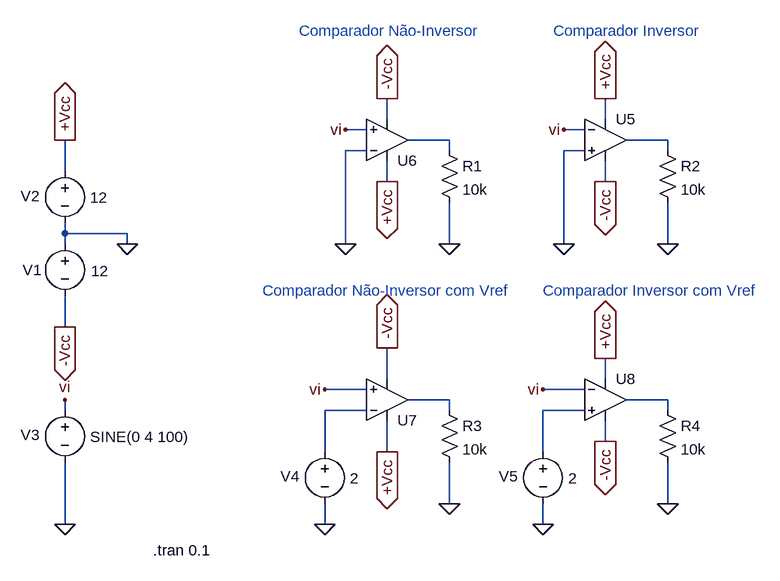
[diagram p0: schematic simulacao_comparadores.asc]
simulacao_comparadores.asc, the LTspice schematic file:
Version 4
SHEET 1 1264 744
WIRE 224 64 224 32
WIRE 560 64 560 32
WIRE 192 80 160 80
WIRE 528 80 496 80
WIRE 320 96 256 96
WIRE 656 96 592 96
WIRE 192 112 160 112
WIRE 320 112 320 96
WIRE 528 112 496 112
WIRE 656 112 656 96
WIRE -272 144 -272 96
WIRE 224 160 224 128
WIRE 560 160 560 128
WIRE -272 240 -272 224
WIRE -176 240 -272 240
WIRE -272 256 -272 240
WIRE -176 256 -176 240
WIRE 160 256 160 112
WIRE 320 256 320 192
WIRE 496 256 496 112
WIRE 656 256 656 192
WIRE -272 384 -272 336
WIRE 224 464 224 416
WIRE 560 464 560 432
WIRE 192 480 128 480
WIRE 528 480 464 480
WIRE 320 496 256 496
WIRE 656 496 592 496
WIRE -272 512 -272 496
WIRE 192 512 128 512
WIRE 320 512 320 496
WIRE 528 512 464 512
WIRE 656 512 656 496
WIRE 560 560 560 528
WIRE 128 576 128 512
WIRE 224 576 224 528
WIRE 464 576 464 512
WIRE 320 656 320 592
WIRE 656 656 656 592
WIRE -272 688 -272 592
WIRE 128 688 128 656
WIRE 464 688 464 656
FLAG -176 256 0
FLAG -272 96 +Vcc
IOPIN -272 96 Out
FLAG -272 384 -Vcc
IOPIN -272 384 Out
FLAG 224 160 +Vcc
IOPIN 224 160 Out
FLAG 560 32 +Vcc
IOPIN 560 32 Out
FLAG 224 576 +Vcc
IOPIN 224 576 Out
FLAG 560 432 +Vcc
IOPIN 560 432 Out
FLAG 224 32 -Vcc
IOPIN 224 32 Out
FLAG 560 160 -Vcc
IOPIN 560 160 Out
FLAG 224 416 -Vcc
IOPIN 224 416 Out
FLAG 560 560 -Vcc
IOPIN 560 560 Out
FLAG 160 256 0
FLAG -272 688 0
FLAG -272 496 vi
FLAG 160 80 vi
FLAG 496 80 vi
FLAG 128 480 vi
FLAG 464 480 vi
FLAG 496 256 0
FLAG 128 688 0
FLAG 464 688 0
FLAG 320 256 0
FLAG 656 256 0
FLAG 320 656 0
FLAG 656 656 0
SYMBOL voltage -272 240 R0
WINDOW 0 -65 56 Left 2
WINDOW 3 40 58 Left 2
WINDOW 123 0 0 Left 2
WINDOW 39 0 0 Left 2
SYMATTR InstName V1
SYMATTR Value 12
SYMBOL voltage -272 128 R0
WINDOW 0 -68 54 Left 2
WINDOW 3 39 57 Left 2
WINDOW 123 0 0 Left 2
WINDOW 39 0 0 Left 2
SYMATTR InstName V2
SYMATTR Value 12
SYMBOL voltage -272 496 R0
WINDOW 0 -68 54 Left 2
WINDOW 3 39 57 Left 2
WINDOW 123 39 85 Left 2
WINDOW 39 0 0 Left 2
SYMATTR InstName V3
SYMATTR Value SINE(0 4 100)
SYMBOL voltage 128 560 R0
WINDOW 0 -68 54 Left 2
WINDOW 3 39 57 Left 2
WINDOW 123 0 0 Left 2
WINDOW 39 0 0 Left 2
SYMATTR InstName V4
SYMATTR Value 2
SYMBOL voltage 464 560 R0
WINDOW 0 -68 54 Left 2
WINDOW 3 39 57 Left 2
WINDOW 123 0 0 Left 2
WINDOW 39 0 0 Left 2
SYMATTR InstName V5
SYMATTR Value 2
SYMBOL Opamps\\UniversalOpamp2 560 96 R0
SYMATTR InstName U5
SYMBOL Opamps\\UniversalOpamp2 224 96 M180
SYMATTR InstName U6
SYMBOL Opamps\\UniversalOpamp2 224 496 M180
SYMATTR InstName U7
SYMBOL Opamps\\UniversalOpamp2 560 496 R0
SYMATTR InstName U8
SYMBOL res 304 96 R0
SYMATTR InstName R1
SYMATTR Value 10k
SYMBOL res 640 96 R0
SYMATTR InstName R2
SYMATTR Value 10k
SYMBOL res 304 496 R0
SYMATTR InstName R3
SYMATTR Value 10k
SYMBOL res 640 496 R0
SYMATTR InstName R4
SYMATTR Value 10k
TEXT -136 728 Left 2 !.tran 0.1
TEXT 88 -72 Left 2 ;Comparador Não-Inversor
TEXT 480 -72 Left 2 ;Comparador Inversor
TEXT 32 328 Left 2 ;Comparador Não-Inversor com Vref
TEXT 464 328 Left 2 ;Comparador Inversor com Vref

The netlist it stands for:
* simulacao_comparadores.asc
V1 0 -Vcc 12
V2 +Vcc 0 12
V3 vi 0 SINE(0 4 100)
V4 N005 0 2
V5 N006 0 2
XU5 0 vi +Vcc -Vcc N002 level.2 Avol=1Meg GBW=10Meg Slew=10Meg ilimit=25m rail=0 Vos=0 phimargin=45 en=0 enk=0 in=0 ink=0 Rin=500Meg  ; pins IN+ IN- V+ V- OUT
XU6 vi 0 +Vcc -Vcc N001 level.2 Avol=1Meg GBW=10Meg Slew=10Meg ilimit=25m rail=0 Vos=0 phimargin=45 en=0 enk=0 in=0 ink=0 Rin=500Meg  ; pins IN+ IN- V+ V- OUT
XU7 vi N005 +Vcc -Vcc N003 level.2 Avol=1Meg GBW=10Meg Slew=10Meg ilimit=25m rail=0 Vos=0 phimargin=45 en=0 enk=0 in=0 ink=0 Rin=500Meg  ; pins IN+ IN- V+ V- OUT
XU8 N006 vi +Vcc -Vcc N004 level.2 Avol=1Meg GBW=10Meg Slew=10Meg ilimit=25m rail=0 Vos=0 phimargin=45 en=0 enk=0 in=0 ink=0 Rin=500Meg  ; pins IN+ IN- V+ V- OUT
R1 N001 0 10k
R2 N002 0 10k
R3 N003 0 10k
R4 N004 0 10k
.tran 0.1
* Comparador Não-Inversor
* Comparador Inversor
* Comparador Não-Inversor com Vref
* Comparador Inversor com Vref
.lib UniversalOpamps2.sub
.backanno
.end